# Altium schematic sheet 0_AASTM32_Overview.SchDoc
size A2; SheetNumber: 1; SheetTotal: 4
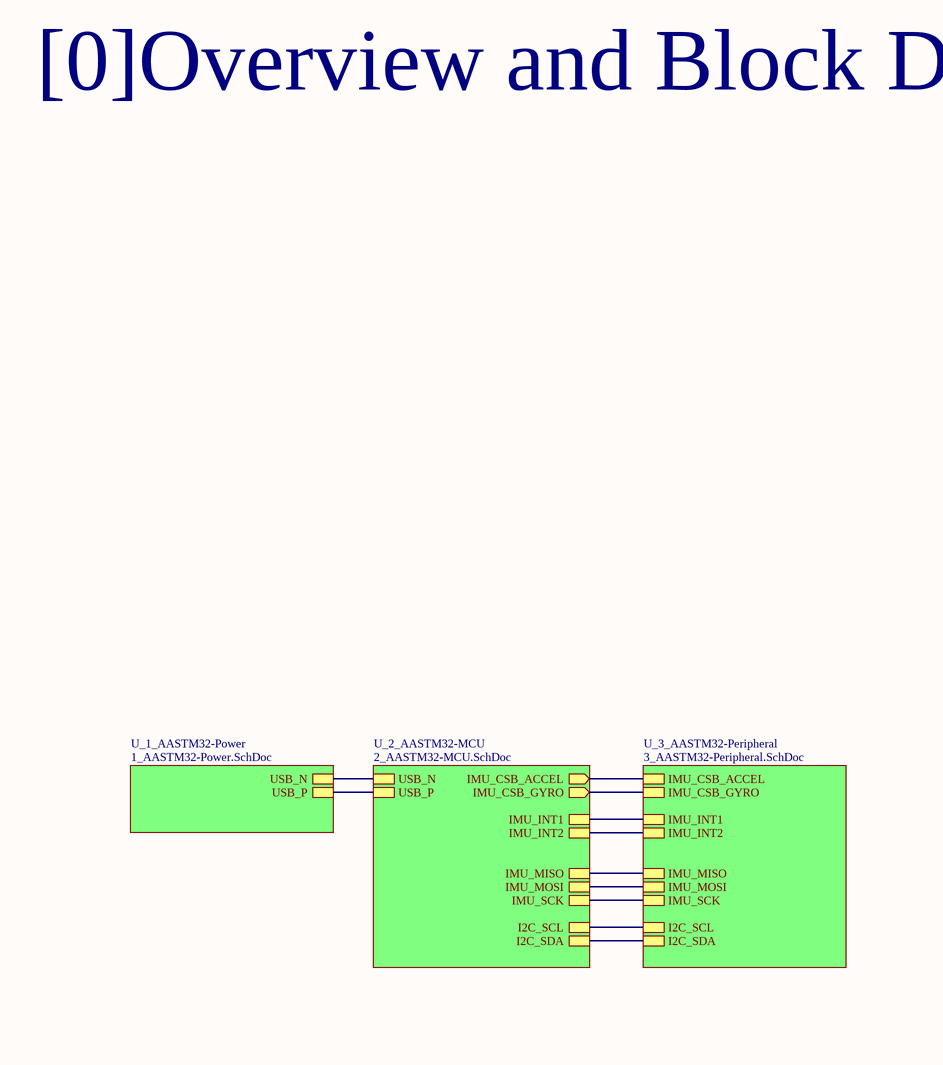
[diagram p0: 0_AASTM32_Overview.SchDoc, left]
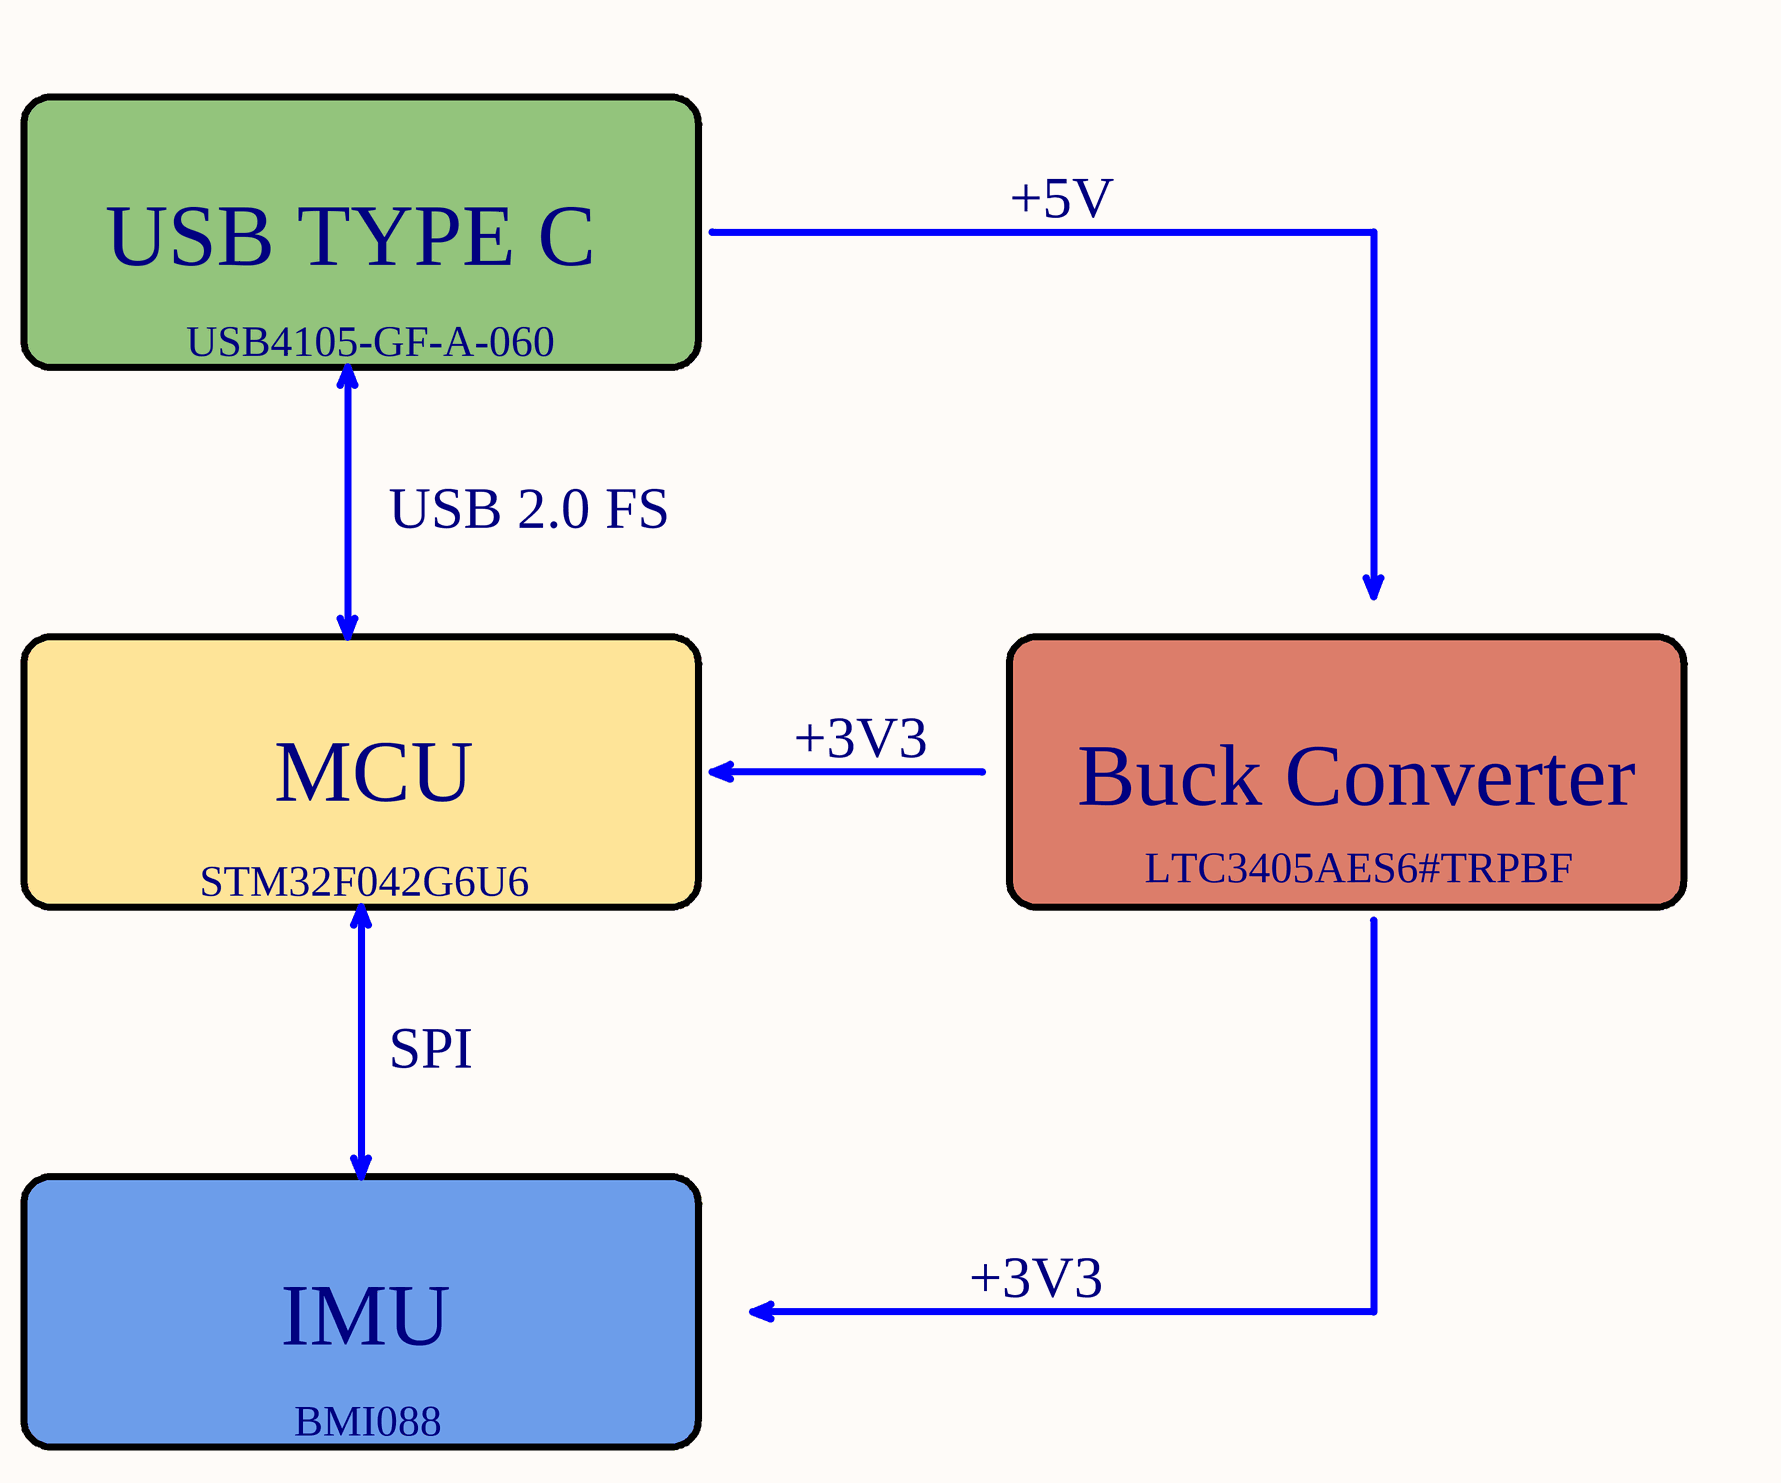
[diagram p1: 0_AASTM32_Overview.SchDoc, right]

## Sub-sheets
U_1_AASTM32-Power = 1_AASTM32-Power.SchDoc: USB_N, USB_P
U_2_AASTM32-MCU = 2_AASTM32-MCU.SchDoc: USB_N, USB_P, IMU_INT1, IMU_INT2, IMU_MISO, IMU_CSB_ACCEL (out), IMU_CSB_GYRO (out), IMU_MOSI, IMU_SCK, I2C_SCL, I2C_SDA
U_3_AASTM32-Peripheral = 3_AASTM32-Peripheral.SchDoc: IMU_INT1, IMU_INT2, IMU_MISO, IMU_CSB_ACCEL, IMU_CSB_GYRO, IMU_MOSI, IMU_SCK, I2C_SCL, I2C_SDA

## Nets
(unnamed): sheet U_1_AASTM32-Power/USB_N, sheet U_2_AASTM32-MCU/USB_N
(unnamed): sheet U_1_AASTM32-Power/USB_P, sheet U_2_AASTM32-MCU/USB_P
(unnamed): sheet U_2_AASTM32-MCU/IMU_INT1, sheet U_3_AASTM32-Peripheral/IMU_INT1
(unnamed): sheet U_2_AASTM32-MCU/IMU_INT2, sheet U_3_AASTM32-Peripheral/IMU_INT2
(unnamed): sheet U_2_AASTM32-MCU/IMU_MISO, sheet U_3_AASTM32-Peripheral/IMU_MISO
(unnamed): sheet U_2_AASTM32-MCU/IMU_CSB_ACCEL, sheet U_3_AASTM32-Peripheral/IMU_CSB_ACCEL
(unnamed): sheet U_2_AASTM32-MCU/IMU_CSB_GYRO, sheet U_3_AASTM32-Peripheral/IMU_CSB_GYRO
(unnamed): sheet U_2_AASTM32-MCU/IMU_MOSI, sheet U_3_AASTM32-Peripheral/IMU_MOSI
(unnamed): sheet U_2_AASTM32-MCU/IMU_SCK, sheet U_3_AASTM32-Peripheral/IMU_SCK
(unnamed): sheet U_2_AASTM32-MCU/I2C_SCL, sheet U_3_AASTM32-Peripheral/I2C_SCL
(unnamed): sheet U_2_AASTM32-MCU/I2C_SDA, sheet U_3_AASTM32-Peripheral/I2C_SDA

## Notes on the sheet
- [0]Overview and Block Diagram
- +5V
- USB TYPE C
- USB4105-GF-A-060
- USB 2.0 FS
- MCU
- +3V3
- Buck Converter
- STM32F042G6U6
- LTC3405AES6#TRPBF
- SPI
- IMU
- BMI088